# EAGLE design Lithiumversion_2019_09_02 (EAGLE 9.4.2)
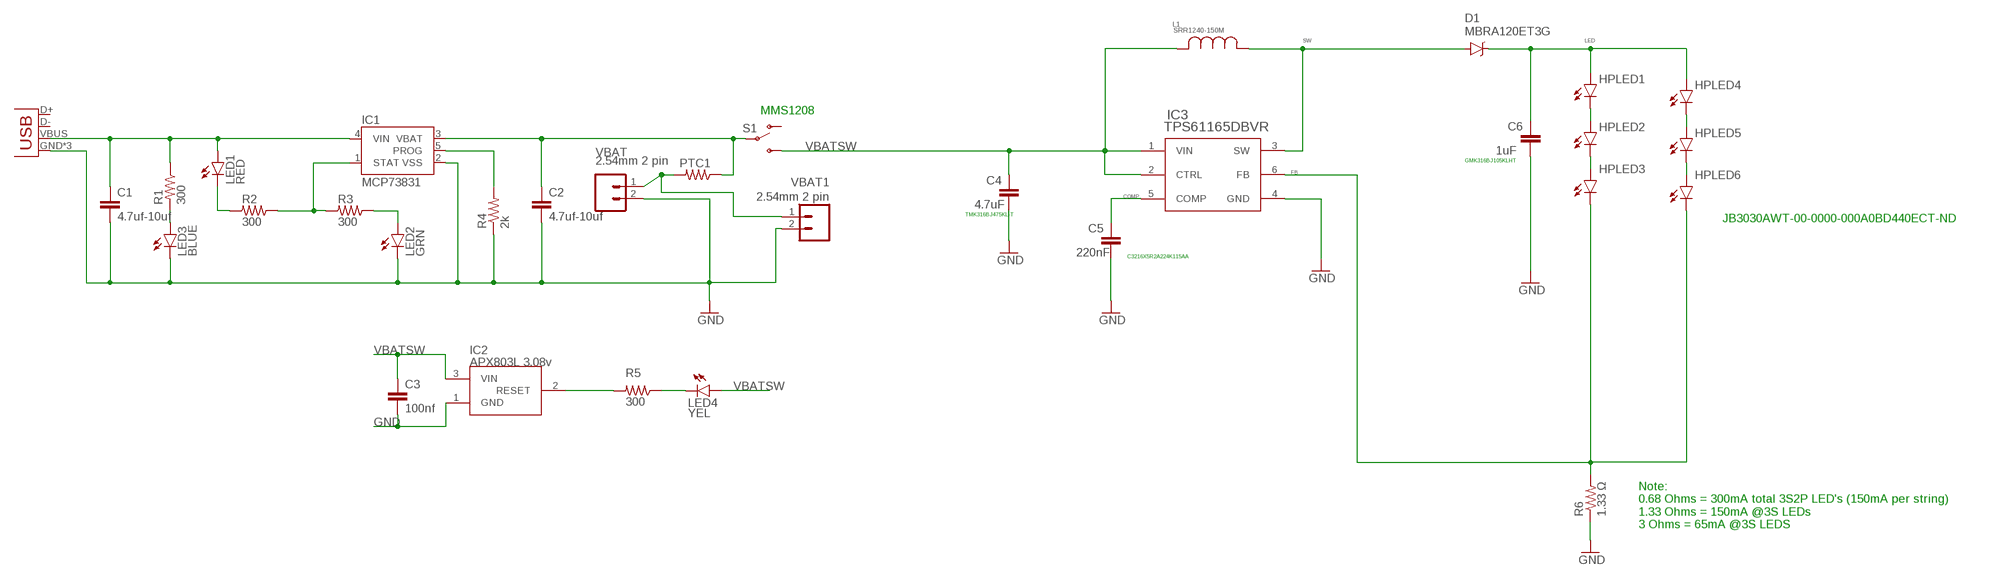
[diagram p0: schematic, sheet 1]

## Parts
C1  4.7uf-10uf  CAP1206  [1206]
C2  4.7uf-10uf  CAP1206  [1206]
C3  100nf  CAP1206  [1206]
C4  4.7uF  CAP1206  [1206]
C5  220nF  CAP1206  [1206]
C6  1uF  CAP1206  [1206]
D1  MBRA120ET3G  DIODE-SCHOTTKY-B340A  [SMA-DIODE]
HPLED1  CREE_J_3030  [CREE_J_3030]
HPLED2  CREE_J_3030  [CREE_J_3030]
HPLED3  CREE_J_3030  [CREE_J_3030]
HPLED4  CREE_J_3030  [CREE_J_3030]
HPLED5  CREE_J_3030  [CREE_J_3030]
HPLED6  CREE_J_3030  [CREE_J_3030]
IC1  MCP73831  [SOT23-5]
IC2  APX803L 3.08v  ADP160  [SOT23]
IC3  TPS61165DBVR  [DBV6]
JP3  USB-MICROB  [USB-MICROB]
L1  SRR1240-150M  SRR1240-100M  [IND_BOURNS_SRR1240]
LED1  RED  LED1206  [LED-1206]
LED2  GRN  LED1206  [LED-1206]
LED3  BLUE  LED1206  [LED-1206]
LED4  YEL  LED1206  [LED-1206]
PTC1  RESISTOR1206  [1206]
R1  300  RESISTOR1206  [1206]
R2  300  RESISTOR1206  [1206]
R3  300  RESISTOR1206  [1206]
R4  2k  RESISTOR1206  [1206]
R5  300  RESISTOR1206  [1206]
R6  1.33 Ω  RESISTOR1206  [1206]
S1  SWITCH-SPDTKIT  [SWITCH-SPDT_KIT]
VBAT  2.54mm 2 pin  M02JST-PTH-VERT  [JST-2-PTH-VERT]
VBAT1  2.54mm 2 pin  M02JST-PTH-VERT  [JST-2-PTH-VERT]

## Nets
COMP: C5.2 IC3.5(COMP)
FB: HPLED3.C HPLED6.C IC3.6(FB) R6.2
GND: C1.2 C2.2 C3.2 C4.1 C5.1 C6.1 IC1.2(VSS) IC2.1(GND) IC3.4(GND) JP3.GND JP3.MT1(GND) JP3.MT2(GND) LED2.C LED3.C R4.1 R6.1 VBAT1.2 VBAT.2
LED: C6.2 D1.C HPLED1.A HPLED1.A2(A) HPLED4.A HPLED4.A2(A)
N$2: PTC1.2 VBAT1.1 VBAT.1
N$3: LED1.C R2.2
N$6: IC1.1(STAT) R2.1 R3.2
N$7: IC1.5(PROG) R4.2
N$8: C1.1 IC1.4(VIN) JP3.VBUS LED1.A R1.1
N$9: LED2.A R3.1
N$10: IC2.2(RESET) R5.2
N$11: LED3.A R1.2
N$12: LED4.C R5.1
N$15: HPLED1.C HPLED2.A HPLED2.A2(A)
N$16: HPLED2.C HPLED3.A HPLED3.A2(A)
N$18: HPLED4.C HPLED5.A HPLED5.A2(A)
N$19: HPLED5.C HPLED6.A HPLED6.A2(A)
SW: D1.A IC3.3(SW) L1.1
VBATSW: C3.1 C4.2 IC2.3(VIN) IC3.1(VIN) IC3.2(CTRL) L1.2 LED4.A S1.3(S)
VCHARGE: C2.1 IC1.3(VBAT) PTC1.1 S1.2(P)
Unconnected: JP3.D+ JP3.D- S1.1(O)

## Notes on the sheet
- ‎MMS1208‎
- GMK316BJ105KLHT
- ‎TMK316BJ475KL-T‎
- JB3030AWT-00-0000-000A0BD440ECT-ND
- ‎C3216X5R2A224K115AA‎
- Note:
  0.68 Ohms = 300mA total 3S2P LED's (150mA per string)
  1.33 Ohms = 150mA @3S LEDs
  3 Ohms = 65mA @3S LEDS

## Library data of the parts
C1-C3 = SparkFun-Capacitors:CAP: Capacitor Standard 0603 ceramic capacitor, and 0.1" leaded capacitor.
C4-C6 = SparkFun-Passives:CAP: Capacitor Standard 0603 ceramic capacitor, and 0.1" leaded capacitor.
D1 = SparkFun-DiscreteSemi:DIODE-SCHOTTKY: Schottky diodes in SFE's production catalog BAT20J 1A 23V 0.62Vf RB751 120mA 40V 0.37Vf PMEG4005EJ 0.5A 40V 0.42Vf MBRA140 1A 40V 0.5Vf B340A 3A 40V SMA; PROD_ID: DIO-09886; VALUE: B340A
HPLED1-HPLED6 = Cree J Series 3030:CREE_J_3030
IC1 = SparkFun-PowerIC:MCP73831: Miniature single cell, fully integrated Li-Ion, Li-polymer charge management controller http://ww1.microchip.com/downloads/en/DeviceDoc/21984a.pdf IC-09995; PROD_ID: IC-09995
IC2 = APX803L:ADP160: RESET GENERATOR SOT23
IC3 = TPS61165:TPS61165DBVR; MANUFACTURER_PART_NUMBER: TPS61165DBVR; VENDOR: Texas Instruments
JP3 = SparkFun-Connectors:USB: USB Connectors USB-B-PTH is fully proven SKU : PRT-00139/CONN-08278 USB-miniB is fully proven SKU : PRT-00587 USB-A-PCB is untested. USB-A-H is throughly reviewed, but untested. Spark Fun Electronics SKU : PRT-00437 USB-B-SMT is throughly reviewed, but untested. Needs silkscreen touching up. USB-A-S has not been used/tested USB-MB-H has not been used/tested USB-MICROB has been used. CONN-09505; PROD_ID: CONN-09505
L1 = SRR1240:SRR1240-100M; MANUFACTURER_PART_NUMBER: SRR1240100M; VENDOR: Bourns Electronics
LED1-LED4 = SparkFun-LED:LED: LEDs Standard schematic elements and footprints for 5mm, 3mm, 1206, and 0603 sized LEDs. 5mm - Spark Fun Electronics SKU : COM-00529 (and others)
PTC1 R1-R5 = SparkFun-Resistors:RESISTOR: Resistor Basic schematic elements and footprints for 0603, 1206, and PTH resistors.
R6 = SparkFun-Passives:RESISTOR: Resistor Basic schematic elements and footprints for 0603, 1206, and PTH resistors.
S1 = SparkFun-Electromechanical:SWITCH-SPDT: SPDT Switch Simple slide switch, Spark Fun Electronics SKU : COM-00102 DPDT SMT slide switch, AYZ0202, SWCH-08179; PROD_ID: SWCH-08261
VBAT VBAT1 = SparkFun-Connectors:M02: Standard 2-pin 0.1" header. Use with - straight break away headers ( PRT-00116) - right angle break away headers (PRT-00553) - swiss pins (PRT-00743) - machine pins (PRT-00117) - female headers (PRT-00115) Molex polarized connector foot print use with: PRT-08233 with associated crimp pins and housings. 2.54_SCREWTERM for use with PRT-10571. 3.5mm Screw Terminal footprints for PRT-08084 5mm Screw Terminal footprints for use with PRT-08432

## Board
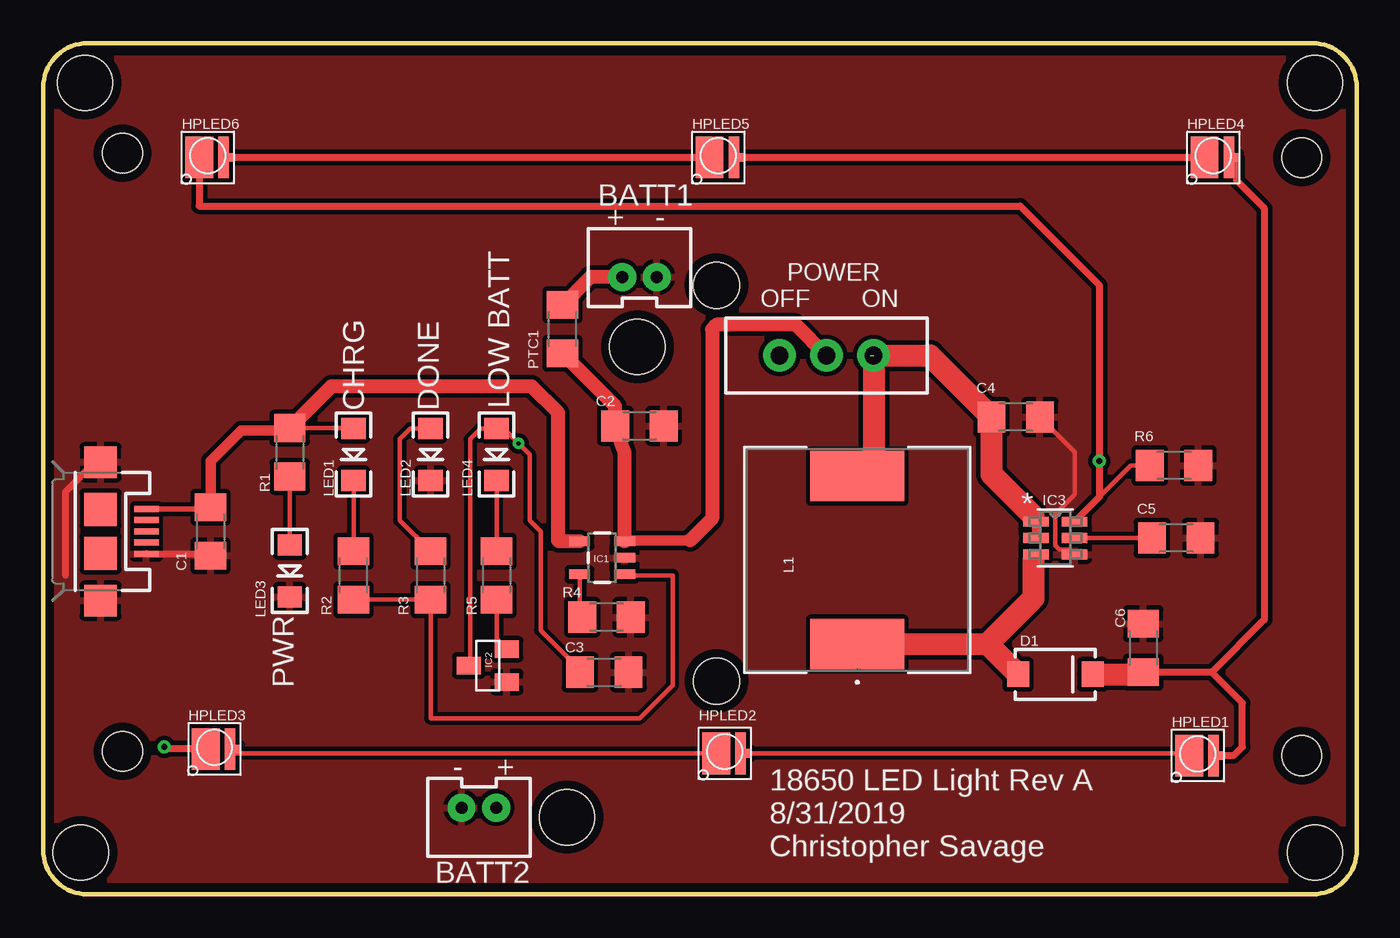
[diagram p1: board, top side]
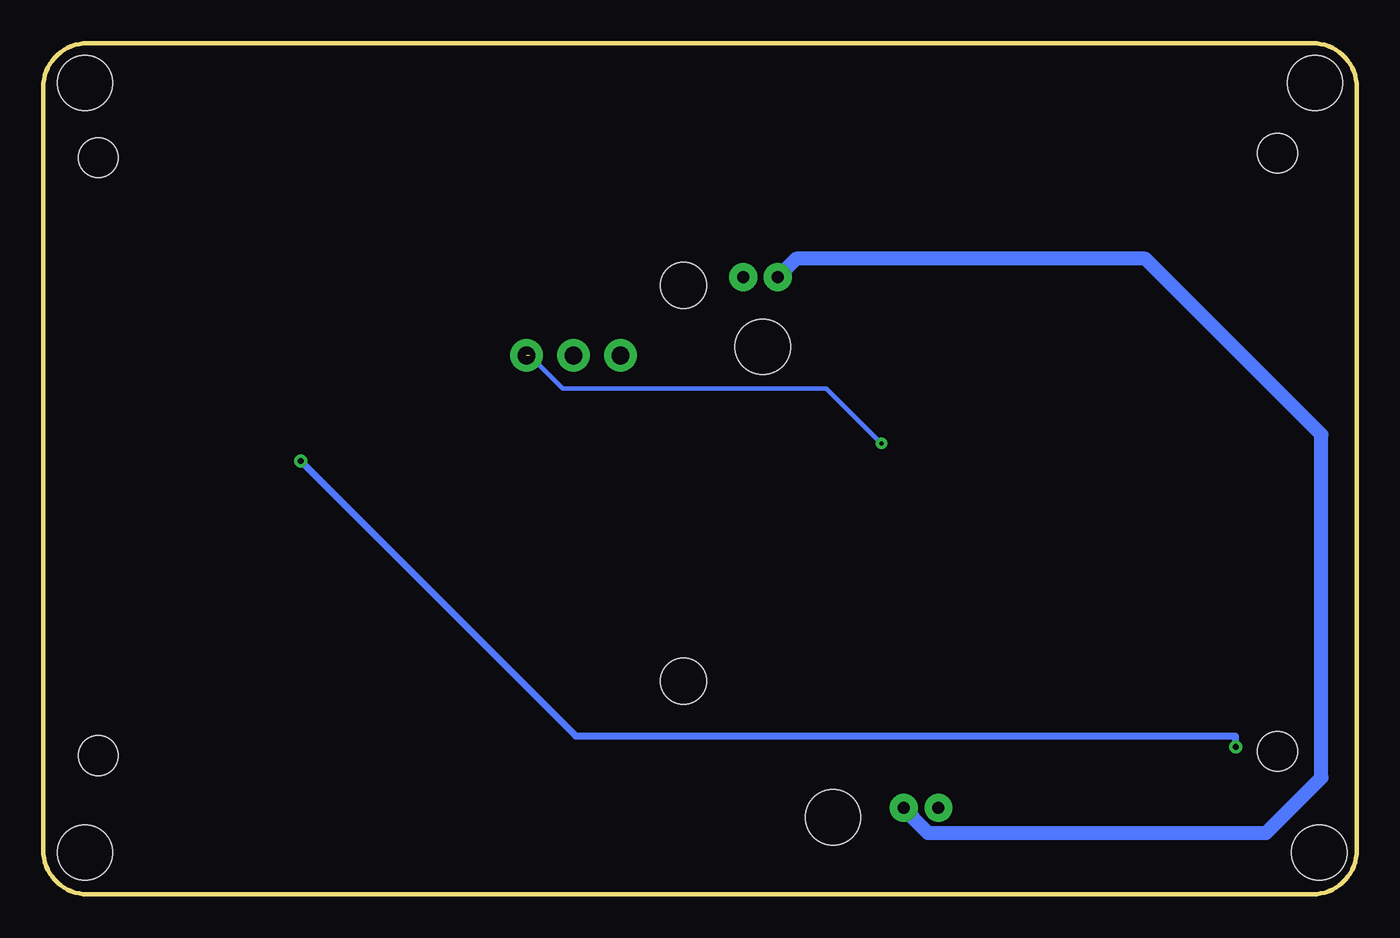
[diagram p2: board, bottom side, seen from below]

Size 75.82 x 49.15 mm. Coordinates in mm from the lower left corner, seen from the top.
Outline: 75.82,46.61 75.82,2.54 arc-90 73.28,0 2.54,0 arc-90 0,2.54 0,46.61 arc-90 2.54,49.15 73.28,49.15 arc-90 75.82,46.61
Copper layers (1*16): Top 0.035mm / dielectric 1.5mm / Bottom 0.035mm
Design rules "default": minimum track width 10mil, minimum drill 10mil, track to track 10mil, track to pad 10mil, pad to pad 10mil, via to via 10mil, smd to smd 8mil, copper to edge 20mil, drill to drill 10mil, minimum pad ring 10mil, minimum via ring 8mil, stop-mask expansion 4mil, vias tented up to drill 0mil, thermal gap 10mil
Holes 2.64 mm at 38.86,35.18 38.86,12.32
Holes 3.17 mm at 2.41,46.86 2.16,2.41 73.41,46.86 73.41,2.41 34.29,31.62 30.23,4.44
Holes 2.29 mm at 4.57,8.25 4.57,42.8 72.64,42.54 72.64,8

### Footprints (pad centres in the part's own frame; a part is rotated, then mirrored left to right if it is on the bottom)
1206 = smd 1.6 x 1.8: 1 -1.4,0; 2 1.4,0
SMA-DIODE = smd 1.27 x 1.47: A -2.15,0; C 2.15,0
CREE_J_3030 = smd 0.6 x 2.4: A 2.4,-0.5 | smd 0.3 x 0.5: A2 2.85,-0.5 | smd 1.6 x 2.4: C 1,-0.5
SOT23-5 = smd 0.55 x 1.2: 1 -0.95,-1.3; 2 0,-1.3; 3 0.95,-1.3; 4 0.95,1.3; 5 -0.95,1.3
SOT23 = smd 1 x 1.4: 1 -0.95,-1.1; 2 0.95,-1.1; 3 0,1.1
DBV6 = smd 1.473 x 0.559: 1 -1.118,0.95; 2 -1.118,0; 3 -1.118,-0.95; 4 1.118,-0.95; 5 1.118,0; 6 1.118,0.95
USB-MICROB = smd 0.35 x 1.4: D+ 0,2.65; D- -0.65,2.65; GND 1.3,2.65; ID 0.65,2.65; VBUS -1.3,2.65 | smd 1.8 x 1.9: MT1 -4,0; MT2 4,0 | smd 1.9 x 1.9: P$1 -1.27,0; P$2 1.27,0
IND_BOURNS_SRR1240 = smd 2.896 x 5.41: 1 -4.851,0; 2 4.851,0
LED-1206 = smd 1.2 x 1.4: A -1.5,0; C 1.5,0
SWITCH-SPDT_KIT = drill 1.016 pad 1.88: 1 0,2.718; 2 0,0; 3 0,-2.718
JST-2-PTH-VERT = drill 0.7 pad 1.6: 1 -1,-0.55; 2 1,-0.55

### Placement (x,y rotation side)
C1  9.65,20.96 270 top
C2  34.42,27.05 0 top
C3  32.38,12.83 0 top
C4  56.13,27.56 180 top
C5  65.4,20.57 180 top
C6  63.5,14.22 270 top
D1  58.42,12.7 0 top
HPLED1  65.15,8.51 0 top
HPLED2  37.85,8.64 0 top
HPLED3  8.38,8.89 0 top
HPLED4  66.04,43.05 0 top
HPLED5  37.47,43.05 0 top
HPLED6  8,43.05 0 top
IC1  32.26,19.43 90 top
IC2  25.65,13.21 90 top
IC3  58.42,20.57 0 top
JP3  3.3,20.96 270 top
L1  46.99,19.3 90 top
LED1  17.91,25.4 270 top
LED2  22.35,25.4 270 top
LED3  14.22,18.67 270 top
LED4  26.16,25.4 270 top
PTC1  29.97,32.64 90 top
R1  14.22,25.53 270 top
R2  17.91,18.42 90 top
R3  22.35,18.42 270 top
R4  32.51,16 180 top
R5  26.16,18.42 270 top
R6  65.28,24.77 180 top
S1  45.21,31.11 90 top
VBAT  34.42,36.2 0 top
VBAT1  25.15,4.44 180 top

### Tracks (layer width: path | path; a pad name or v marks a point on that pad's centre or on a via)
COMP
  Top 0.254: IC3.5 C5.2
FB  (via drill 0.35)
  Top 0.254: IC3.6 62.78,24.77 R6.2
  Top 0.406: IC3.6 60.96,22.95 v60.96,25.02 60.96,35.18 56.39,39.75 9,39.75 HPLED6.C | HPLED3.C 7.1,8.39 v6.99,8.51
  Bottom 0.406: v60.96,25.02 45.09,9.14 6.99,9.14 v6.99,8.51
GND
  Top 0.254: C4.1 59.54,25.55 59.54,23.08 58.42,21.96 58.42,20.14 58.64,19.91 59.25,19.91 IC3.4
  Top 0.406: JP3.GND 9.55,19.66 C1.2 | JP3.MT1 2.98,24.96 1.27,23.24 1.27,18.42 | 2.54,17.14 3.11,17.14
  pour Top (isolate 0.254): -0.51,48.26 81.41,48.26 81.41,-3.81 -0.51,-3.81
LED
  Top 0.254: HPLED4.A2 HPLED4.A | HPLED1.A2 HPLED1.A
  Top 0.406: HPLED1.A 68.71,8.01 69.21,8.51 69.21,11.05 67.44,12.82 | 67.44,12.82 C6.2 | HPLED4.A2 68.89,41.22 70.48,39.62 70.48,15.87 67.44,12.82
  Top 1.27: D1.C 63.38,12.7 C6.2
N$2
  Top 0.813: VBAT.1 31.58,35.64 PTC1.2
  Bottom 0.813: VBAT1.1 25.61,4.46 25.61,4.39 24.75,3.54 5.23,3.54 2.03,6.73 2.03,26.54 12.19,36.7 32.36,36.7 VBAT.1
N$3
  Top 0.254: R2.2 LED1.C
N$6
  Top 0.254: R2.1 R3.2 22.35,10.16 34.42,10.16 36.32,12.07 36.32,18.42 33.78,18.42 IC1.1
N$7
  Top 0.254: IC1.5 30.96,16.16 R4.2
N$8
  Top 0.254: R1.1 17.88,26.93 LED1.A
  Top 0.305: JP3.VBUS 9.55,22.26
  Top 0.61: 9.55,22.26 C1.1 9.65,25.02 11.43,26.8 14.09,26.8 R1.1
  Top 0.813: IC1.4 29.78,20.38 29.72,20.45 29.72,27.81 28.19,29.34 16.63,29.34 R1.1
N$9
  Top 0.254: LED2.A 21.19,26.9 20.57,26.29 20.57,21.59 R3.1
N$10
  Top 0.254: R5.2 26.16,14.75 IC2.2
N$11
  Top 0.254: LED3.A R1.2
N$12
  Top 0.254: R5.1 LED4.C
N$15
  Top 0.254: HPLED1.C 66.02,8.14 HPLED2.A HPLED2.A2
N$16
  Top 0.254: HPLED2.C 11.04,8.14 HPLED3.A HPLED3.A2
N$18
  Top 0.254: HPLED5.A2 HPLED5.A
  Top 0.406: HPLED4.C HPLED5.A
N$19
  Top 0.254: HPLED6.A2 HPLED6.A
  Top 0.406: HPLED5.C HPLED6.A
SW
  Top 0.254: IC3.3 57.3,19.46 57.15,19.3
  Top 1.27: L1.1 54.52,14.45 | 54.52,14.45 D1.A | 54.52,14.45 57.15,17.09 57.15,19.3
VBATSW  (via drill 0.25)  (1 unrouted)
  Top 0.254: IC2.3 24.64,13.29 24.64,26.29 25.25,26.9 LED4.A 26.16,27.3 v27.43,26.04 28.07,25.4 28.07,21.59 28.7,20.96 28.7,15.24 30.61,13.34 C3.1
  Top 0.406: IC3.2 IC3.1 57.15,21.68 57.15,21.84 | L1.2 47.83,24.16 47.93,24.05
  Top 1.27: 47.93,24.05 S1.3 51.18,31.11 C4.2 54.73,24.26 57.15,21.84
  Bottom 0.254: v27.43,26.04 30.61,29.21 45.85,29.21 47.75,31.11
VCHARGE
  Top 0.61: 37.34,20.45 33.62,20.45 IC1.3
  Top 0.813: IC1.3 33.56,25.49 C2.1 33.02,28.19 PTC1.1 | S1.2 43.43,32.89 38.86,32.89 38.61,32.64 38.61,21.72 37.34,20.45

### Text on the board
tPlace: IC3 | 18650 LED Light Rev A / 8/31/2019 / Christopher Savage
tNames: BATT1 | + | - | POWER | OFF | ON | CHRG | DONE | LOW BATT | PWR | - | + | BATT2